# Altium project TP3.PrjPcb
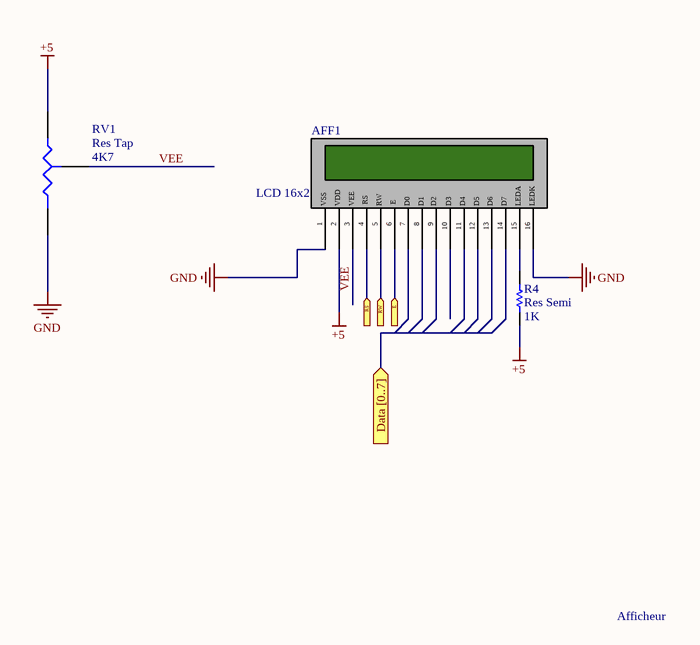
[diagram p0: AFF.SchDoc]
2 sheets, 8 parts. Net scope: flat (ports and power ports of the same name join across sheets).
Sheets:
  AFF.SchDoc
  Sensor.SchDoc

## Sheet AFF.SchDoc
size A4; SheetNumber: 1; SheetTotal: 4

### Parts
AFF1  LCD 16x2
R4  Res Semi  value 1K  [AXIAL-0.5]
RV1  Res Tap  value 4K7  [VR3]

### Ports
Data [0..7] (in), E (in), RS (in), RW (in)

### Nets
+5: AFF1.2 R4.1 RV1.1(A)
GND: AFF1.1 AFF1.16 RV1.2(B)
VEE: AFF1.3 RV1.3(TAP)
NetAFF1_4: AFF1.4 ; port RS
NetAFF1_5: AFF1.5 ; port RW
NetAFF1_6: AFF1.6 ; port E
NetAFF1_15: AFF1.15 R4.2

Not connected (* = marked no-connect by the designer): AFF1 7 8 9 10 11 12 13 14

### Notes on the sheet
- Afficheur
- (in symbol LCD 16x2) VSS; VDD; VEE; RS; RW; E; D0; D1; D2; D3; D4; D5; D6; D7; LEDA; LEDK

### Library data of the parts
R4 = Res Semi: Semiconductor Resistor; Published: 8-Jun-2000; LatestRevisionDate: 17-Jul-2002; LatestRevisionNote: Re-released for DXP Platform.; PackageReference: AXIAL-0.5; Publisher: Altium Limited; PackageDescription: Axial Device, Thru-Hole; 2 Leads; 0.5 in Pin Spacing
RV1 = Res Tap: Tapped Resistor; Sim Note: Enter the Resistance value and the set point into parameter fields.; Set Position: 0.5; Published: 24-Mar-1999; LatestRevisionDate: 17-Jul-2002; LatestRevisionNote: Re-released for DXP Platform.; PackageReference: VR3; Publisher: Altium Limited; PackageDescription: Variable Resistor, Thru-Hole; 3 Leads

## Sheet Sensor.SchDoc
size Letter; SheetNumber: 3; SheetTotal: 3
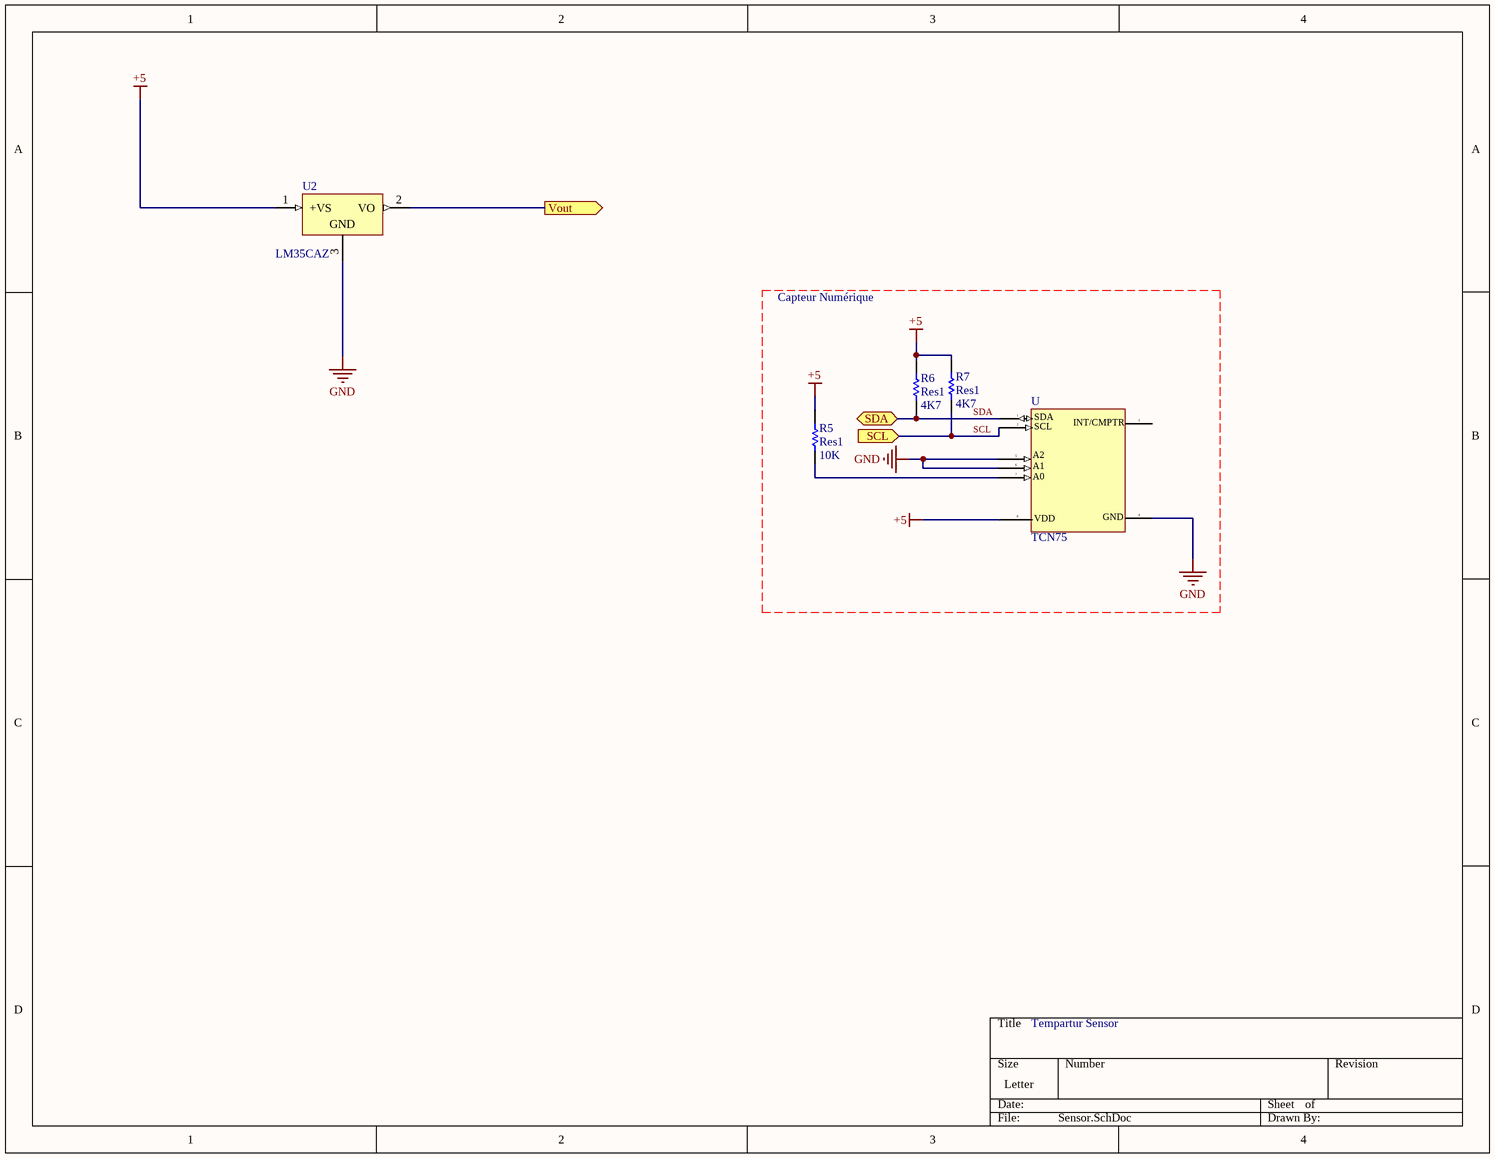
[diagram p1: Sensor.SchDoc]

### Parts
R5  Res1  value 10K  [AXIAL-0.3]
R6  Res1  value 4K7  [AXIAL-0.3]
R7  Res1  value 4K7  [AXIAL-0.3]
U  TCN75
U2  LM35CAZ  [Z03A]

### Ports
SCL (in), SDA (bidir), Vout (out)

### Nets
+5: R5.2 R6.2 R7.2 U.8 U2.1(+VS)
GND: U.4 U.5 U.6 U2.3(GND)
SCL: R7.1 U.2 ; port SCL
SDA: R6.1 U.1 ; port SDA
NetR5_1: R5.1 U.7
NetU2_2: U2.2(VO) ; port Vout

Not connected (* = marked no-connect by the designer): U 3

### Notes on the sheet
- Capteur Numérique
- Tempartur Sensor
- (in symbol TCN75) SDA; SCL; INT/CMPTR; A2; A1; A0; VDD; GND

### Library data of the parts
R5-R7 = Res1: Resistor; Published: 8-Jun-2000; LatestRevisionDate: 17-Jul-2002; LatestRevisionNote: Re-released for DXP Platform.; PackageReference: AXIAL-0.3; Publisher: Altium Limited; PackageDescription: Axial Device, Thru-Hole; 2 Leads; 0.3 in Pin Spacing
U2 = LM35CAZ: Precision Centigrade Temperature Sensor, 3-pin TO-92; Manufacturer: National Semiconductor; PackageTopMarking: NSXYTT*LM35*CAZ; PowerWise: N; CompType: Temp Sensor IC; Published: 4-Dec-2008; LatestRevisionDate: 15-Jul-2009; LatestRevisionNote: Sch pins 1 & 3 reversed.; DatasheetVersion: Nov-2000; PackageVersion: revG, Sep-2000; PackageReference: Z03A; Publisher: Altium Limited; PackageDescription: TO-92, Molded, 3 Lead; Supplier 1: Farnell; Supplier Part Number 1: 9494529; PartNumber: LM35CAZ; RoHS: N; PinCount: 3; Code_JEDEC: TO-226-AA; ComponentLink1Description: LM35 Datasheet; ComponentLink1URL: http://www.national.com/ds/LM/LM35.pdf; ComponentLink2Description: LM35 Web Page; ComponentLink2URL: http://www.national.com/pf/LM/LM35.html; ComponentLink3Description: Z03A Package Page; ComponentLink3URL: http://www.national.com/packaging/folders/z03a.html

## Nets that join several sheets
+5: AFF (AFF1.2 R4.1 RV1.1), Sensor (5 pins)
GND: AFF (AFF1.1 AFF1.16 RV1.2), Sensor (U.4 U.5 U.6 U2.3)